# EAGLE design ChillmonBoard (EAGLE 6.3)
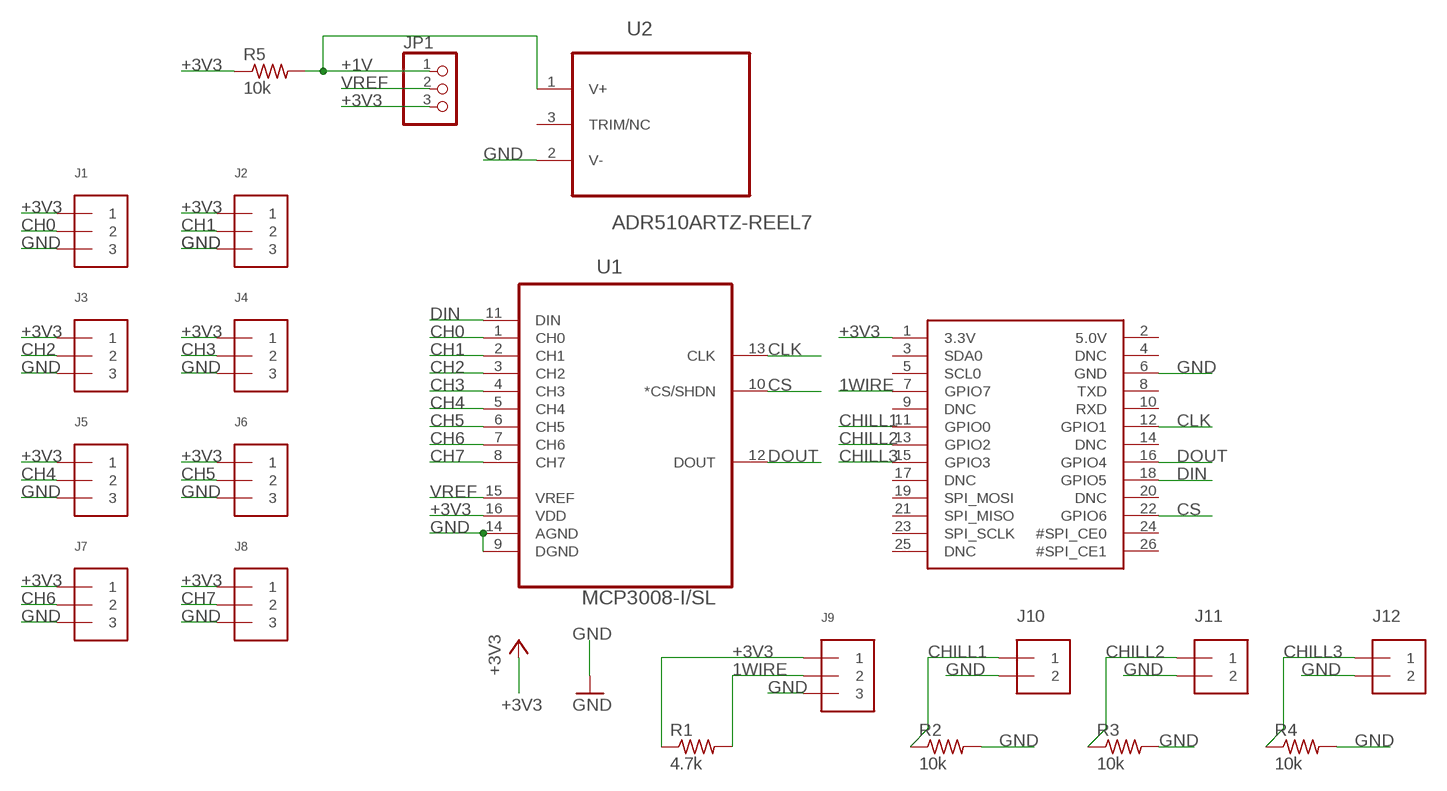
[diagram p0: schematic, sheet 1]

## Parts
J1  TERMBLOCK_1X3  [TERMBLOCK_1X3-3.5MM]
J2  TERMBLOCK_1X3  [TERMBLOCK_1X3-3.5MM]
J3  TERMBLOCK_1X3  [TERMBLOCK_1X3-3.5MM]
J4  TERMBLOCK_1X3  [TERMBLOCK_1X3-3.5MM]
J5  TERMBLOCK_1X3  [TERMBLOCK_1X3-3.5MM]
J6  TERMBLOCK_1X3  [TERMBLOCK_1X3-3.5MM]
J7  TERMBLOCK_1X3  [TERMBLOCK_1X3-3.5MM]
J8  TERMBLOCK_1X3  [TERMBLOCK_1X3-3.5MM]
J9  TERMBLOCK_1X3  [TERMBLOCK_1X3-3.5MM]
J10  1X2-3.5MM  [1X2-3.5MM]
J11  1X2-3.5MM  [1X2-3.5MM]
J12  1X2-3.5MM  [1X2-3.5MM]
JP1  PINHD-1X3  [1X03]
R1  4.7k  R-US_R0805  [R0805]
R2  10k  R-US_R0805  [R0805]
R3  10k  R-US_R0805  [R0805]
R4  10k  R-US_R0805  [R0805]
R5  10k  R-US_R0805  [R0805]
U1  MCP3008-I/SL  [SOIC127P600X175-16N]
U2  ADR510ARTZ-REEL7  [SOT95P237X112-3N]
U$1  RASPBERRYPI_BB  [RASBERRYPI_SHIELD]

## Nets
1WIRE: J9.2 R1.2 U$1.7(GPIO7)
+1V: JP1.1 R5.2 U2.1(V+)
+3V3: J1.1 J2.1 J3.1 J4.1 J5.1 J6.1 J7.1 J8.1 J9.1 JP1.3 R1.1 R5.1 U1.16(VDD) U$1.1(3.3V)
CH0: J1.2 U1.1(CH0)
CH1: J2.2 U1.2(CH1)
CH2: J3.2 U1.3(CH2)
CH3: J4.2 U1.4(CH3)
CH4: J5.2 U1.5(CH4)
CH5: J6.2 U1.6(CH5)
CH6: J7.2 U1.7(CH6)
CH7: J8.2 U1.8(CH7)
CHILL1: J10.1 R2.1 U$1.11(GPIO0)
CHILL2: J11.1 R3.1 U$1.13(GPIO2)
CHILL3: J12.1 R4.1 U$1.15(GPIO3)
CLK: U1.13(CLK) U$1.12(GPIO1)
CS: U1.10(*CS/SHDN) U$1.22(GPIO6)
DIN: U1.11(DIN) U$1.18(GPIO5)
DOUT: U1.12(DOUT) U$1.16(GPIO4)
GND: J1.3 J2.3 J3.3 J4.3 J5.3 J6.3 J7.3 J8.3 J9.3 J10.2 J11.2 J12.2 R2.2 R3.2 R4.2 U1.9(DGND) U1.14(AGND) U2.2(V-) U$1.6(GND)
VREF: JP1.2 U1.15(VREF)
Unconnected: U2.3(TRIM/NC) U$1.2(5.0V) U$1.3(SDA0) U$1.4(DNC) U$1.5(SCL0) U$1.8(TXD) U$1.9(DNC) U$1.10(RXD) U$1.14(DNC) U$1.17(DNC) U$1.19(SPI_MOSI) U$1.20(DNC) U$1.21(SPI_MISO) U$1.23(SPI_SCLK) U$1.24(#SPI_CE0) U$1.25(DNC) U$1.26(#SPI_CE1)

## Notes on the sheet
- J10 | J11 | J12

## Library data of the parts
J1-J9 = microbuilder:TERMBLOCK_1X3: 3.5mm Terminal block http://www.ladyada.net/library/pcb/eaglelibrary.html
J10-J12 = adafruit:1X2: 3.5mm Terminal block http://www.ladyada.net/library/pcb/eaglelibrary.html
JP1 = adafruit:PINHD-1X3: PIN HEADER
R1-R5 = adafruit:R-US_: RESISTOR, American symbol
U1 = MCP3008:MCP3008-I/SL: 10BIT ADC, 8 CH, SPI, SMD; MPN: MCP3008-I/SL; OC_FARNELL: 1292241; OC_NEWARK: 19C7201; PACKAGE: SOIC16; SUPPLIER: Microchip
U2 = ADR510:ADR510ARTZ-REEL7: 1.0 V Precision Low Noise Shunt Voltage Reference; MPN: ADR510ARTZ-REEL7; OC_FARNELL: -; OC_NEWARK: 19M8736; PACKAGE: SOT-23-3; SUPPLIER: Analog Devices
U$1 = microbuilder-ryan:RASPBERRYPI_B

## Board
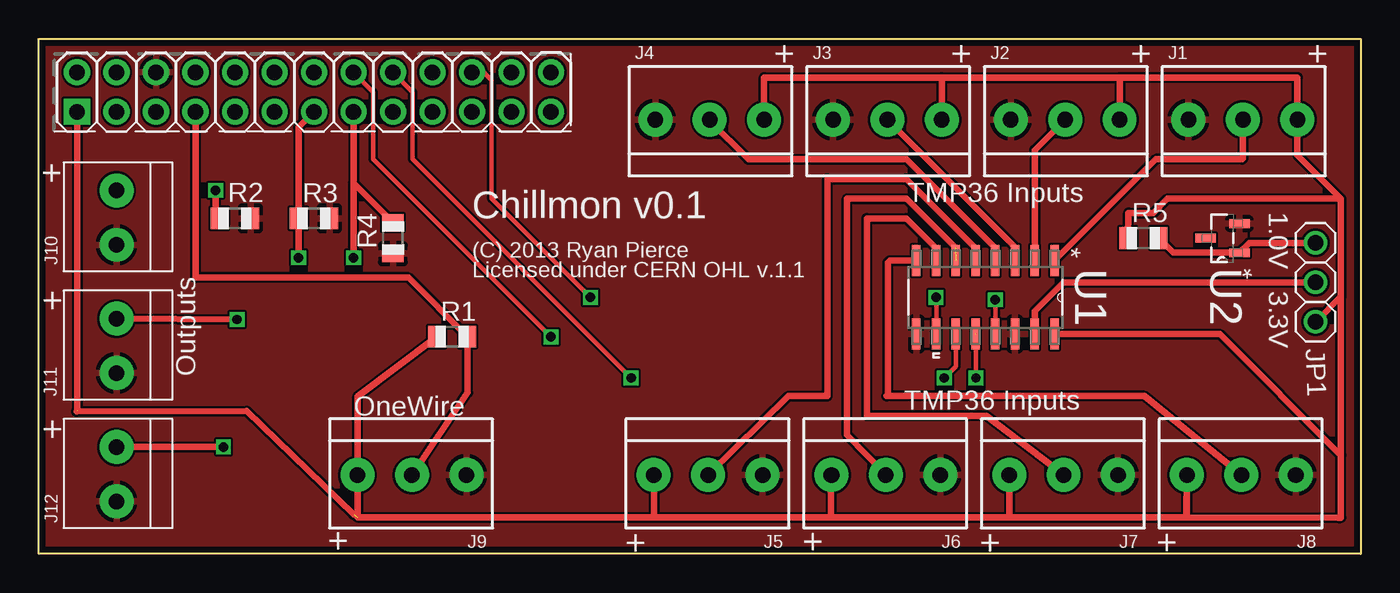
[diagram p1: board, top side]
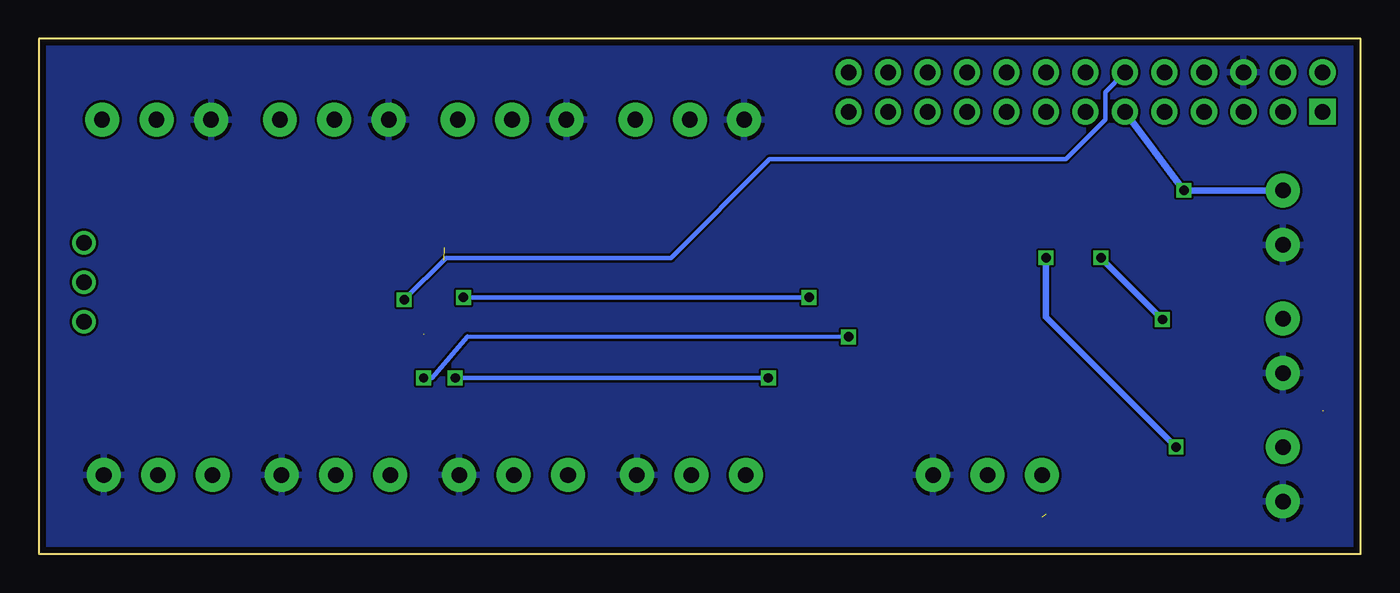
[diagram p2: board, bottom side, seen from below]

Size 85 x 33.14 mm. Coordinates in mm from the lower left corner, seen from the top.
Copper layers (1*16): Top 0.0356mm / dielectric 1.5011mm / Bottom 0.0356mm
Design rules "LaenPCBOrder": minimum track width 6mil, minimum drill 13mil, track to track 6mil, track to pad 6mil, pad to pad 6mil, via to via 6mil, smd to smd 6mil, copper to edge 15mil, drill to drill 6mil, minimum pad ring 7mil, minimum via ring 7mil, stop-mask expansion 4mil, vias tented up to drill 0mil, thermal gap 10mil

### Footprints (pad centres in the part's own frame; a part is rotated, then mirrored left to right if it is on the bottom)
TERMBLOCK_1X3-3.5MM = drill 1 pad 2.184: 1 3.55,0; 2 0.05,0; 3 -3.45,0
1X2-3.5MM = drill 1 pad 2.184: 1 1.8,0; 2 -1.7,0
1X03 = drill 1.016: 1 -2.54,0; 2 0,0; 3 2.54,0
R0805 = smd 1.1 x 1.4: 1 -1,0; 2 1,0
SOIC127P600X175-16N = smd 1.981 x 0.559: 1 -2.362,4.445; 2 -2.362,3.175; 3 -2.362,1.905; 4 -2.362,0.635; 5 -2.362,-0.635; 6 -2.362,-1.905; 7 -2.362,-3.175; 8 -2.362,-4.445; 9 2.362,-4.445; 10 2.362,-3.175; 11 2.362,-1.905; 12 2.362,-0.635; 13 2.362,0.635; 14 2.362,1.905; 15 2.362,3.175; 16 2.362,4.445
SOT95P237X112-3N = smd 1.321 x 0.559: 1 -1.092,0.94; 2 -1.092,-0.94; 3 1.092,0
RASBERRYPI_SHIELD = drill 1 pad 1.676 square: 1 -15.24,93.218 | drill 1 pad 1.676: 2 -15.24,95.758; 3 -12.7,93.218; 4 -12.7,95.758; 5 -10.16,93.218; 6 -10.16,95.758; 7 -7.62,93.218; 8 -7.62,95.758; 9 -5.08,93.218; 10 -5.08,95.758; 11 -2.54,93.218; 12 -2.54,95.758; 13 0,93.218; 14 0,95.758; 15 2.54,93.218; 16 2.54,95.758; 17 5.08,93.218; 18 5.08,95.758; 19 7.62,93.218; 20 7.62,95.758; 21 10.16,93.218; 22 10.16,95.758; 23 12.7,93.218; 24 12.7,95.758; 25 15.24,93.218; 26 15.24,95.758

### Placement (x,y rotation side)
J1  77.38,27.94 0 top
J2  65.95,27.94 0 top
J3  54.52,27.94 0 top
J4  43.09,27.94 0 top
J5  43.09,5.08 180 top
J6  54.52,5.08 180 top
J7  65.95,5.08 180 top
J8  77.38,5.08 180 top
J9  24.04,5.08 180 top
J10  4.99,21.59 90 top
J11  4.99,13.34 90 top
J12  4.99,5.08 90 top
JP1  82.1,17.48 270 top
R1  26.58,13.97 0 top
R2  12.61,21.59 0 top
R3  17.69,21.59 0 top
R4  22.77,20.32 270 top
R5  71.03,20.32 0 top
U1  60.87,16.51 270 top
U2  76.11,20.32 180 top
U$1  17.69,-64.77 0 top

### Tracks (layer width: path | path; a pad name or v marks a point on that pad's centre or on a via)
1WIRE
  Top 0.406: J9.2 27.58,10.38 R1.2 23.77,17.78 10.07,17.78 U$1.7
+1V
  Top 0.406: R5.2 72.97,19.38 U2.1 77.84,20.02 JP1.1
+3V3  (2 unrouted)
  Top 0.406: 83.73,22.86 80.93,25.66 J1.1 80.93,30.66 69.51,30.66 | 69.51,30.66 J2.1 | J3.1 58.07,30.66 | 58.07,30.66 69.51,30.66 | J4.1 46.64,30.66 58.07,30.66 | J5.1 39.56,5.02 39.56,2.44 39.64,2.36 | 39.64,2.36 50.94,2.36 | 50.94,2.36 62.42,2.36 | 62.42,2.36 73.81,2.36 | 73.81,2.36 73.82,2.36 J8.1 73.81,2.36 | J6.1 50.94,5.05 50.94,2.36 | J7.1 62.42,5.06 62.42,2.36 | 83.73,22.86 83.73,16.56 | 83.73,16.56 JP1.3 | 65.31,14.94 U1.16 75.93,14.15 83.73,6.35 | 73.81,2.36 83.58,2.34 83.73,2.34 83.73,6.35 | 83.73,6.35 83.73,16.56 | 39.64,2.36 20.48,2.36 J9.1 20.5,10.15 R1.1 | U$1.1 2.45,9.25 | 2.43,9.17 13.37,9.2 20.23,2.54 | R5.1 70.06,21.95 71.66,21.95 72.57,22.86 83.73,22.86
CH0
  Top 0.406: J1.2 77.43,25.45 77.38,25.4 71.84,25.4 U1.1
CH1
  Top 0.406: J2.2 64.04,25.99 U1.2
CH2
  Top 0.406: U1.3 62.77,19.74 J3.2
CH3
  Top 0.406: U1.4 61.51,19.69 55.79,25.4 45.63,25.4 43.14,27.89 J4.2
CH4
  Top 0.406: J5.2 48.22,10.16 50.71,10.16 50.71,24.13 55.79,24.13 60.24,19.69 U1.5
CH5  (1 unrouted)
  Top 0.406: J6.2 51.98,7.67 51.98,22.86 55.79,22.86 58.94,19.71 58.97,19.71
CH6
  Top 0.406: J7.2 60.92,8.89 53.25,8.89 53.25,21.59 55.79,21.59 57.7,19.69 U1.7
CH7
  Top 0.406: J8.2 71.08,10.16 54.52,10.16 54.6,10.24 54.6,18.75 54.72,18.87 U1.8
CHILL1  (via drill 0.6)
  Top 0.406: R2.1 11.36,21.84 v11.36,23.39
  Bottom 0.406: U$1.11 v11.36,23.39 J10.1
CHILL2  (via drill 0.6)
  Top 0.406: U$1.13 16.69,27.45 R3.1 v16.69,19.06 v16.7,19.05 | J11.1 v12.74,15.09
  Bottom 0.406: v12.74,15.09 v16.7,19.05
CHILL3  (via drill 0.6)
  Top 0.406: U$1.15 20.23,23.86 | 20.23,23.86 R4.1 | J12.1 v11.87,6.88 | v20.23,19.05 20.23,23.86
  Bottom 0.406: v11.87,6.88 20.23,15.24 v20.23,19.05
CLK  (via drill 0.6)
  Top 0.305: v61.51,16.36 U1.13
  Bottom 0.305: U$1.12 16.42,29.72 16.42,27.94 18.96,25.4 38.01,25.4 44.36,19.05 58.81,19.05 v61.51,16.36
CS  (via drill 0.6)
  Top 0.305: U$1.22 28.61,30.99 29.12,30.48 29.12,22.86 v35.47,16.51 | v57.7,16.51 57.72,16.54 57.72,14.17 U1.10
  Bottom 0.305: v35.47,16.51 v57.7,16.51
DIN  (via drill 0.6)
  Top 0.305: U1.11 58.97,12.07 v58.23,11.33 | v38.09,11.33 24.04,25.4 24.04,29.72 U$1.18
  Bottom 0.305: v58.23,11.33 v38.09,11.33
DOUT  (via drill 0.6)  (1 unrouted)
  Top 0.305: 60.26,14.15 v60.26,11.33 | v32.93,13.97 21.5,25.4 21.5,29.72 U$1.16
  Bottom 0.305: v60.26,11.33 59.7,11.33 57.42,14 v32.93,13.97
GND
  pour Top: -0.09,33.02 85,33.02 85,0 -0.09,0
  pour Bottom: -0.09,33.02 85,33.02 85,0 -0.09,0
VREF
  Top 0.406: U1.15 64.04,15.62 65.9,17.48 JP1.2

### Text on the board
tNames: + | + | + | + | + | TMP36 Inputs | 1.0V | Chillmon v0.1 | (C) 2013 Ryan Pierce | + | Licensed under CERN OHL v.1.1 | 3.3V | Outputs | + | OneWire | TMP36 Inputs | + | + | + | + | +